# Altium schematic sheet ControlPanel.SchDoc
size A; SheetNumber: 6
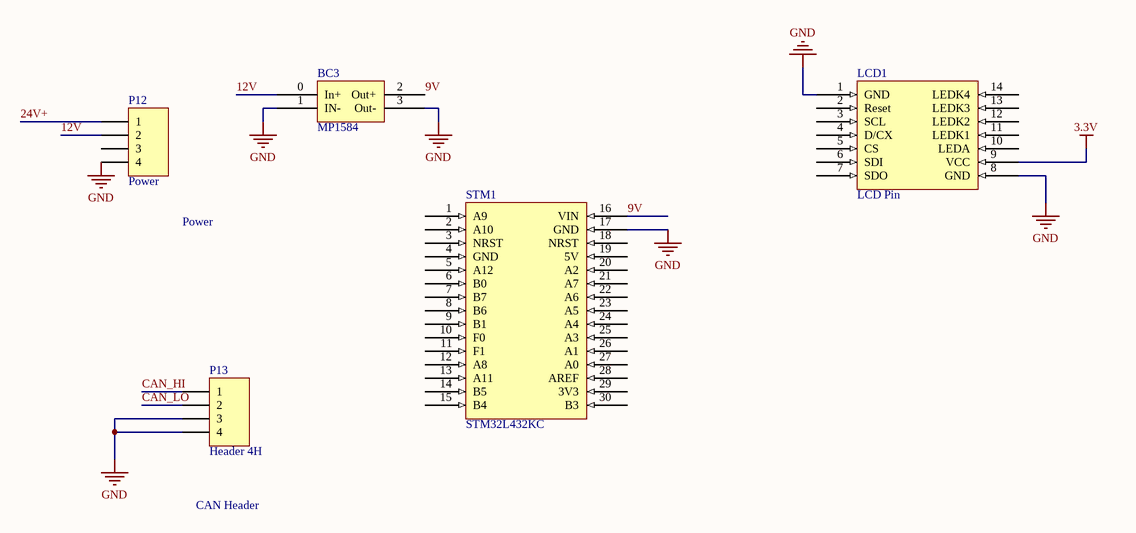
[diagram p0: ControlPanel.SchDoc]

## Parts
BC3  MP1584
LCD1  LCD Pin  [LCD Display Header]
P12  Power  [HDR1X4]
P13  Header 4H  [HDR1X4H]
STM1  STM32L432KC

## Nets
3.3V: LCD1.9(VCC)
GND: BC3.1(IN-) BC3.3(Out-) LCD1.1(GND) LCD1.8(GND) P12.4 P13.3 P13.4 STM1.17(GND)
9V: BC3.2(Out+) STM1.16(VIN)
12V: BC3.0(In+) P12.2
24V+: P12.1
CAN_HI: P13.1
CAN_LO: P13.2

Not connected (* = marked no-connect by the designer): LCD1 2(Reset) 3(SCL) 4(D/CX) 5(CS) 6(SDI) 7(SDO) 10(LEDA) 11(LEDK1) 12(LEDK2) 13(LEDK3) 14(LEDK4); P12 3; STM1 1(A9) 2(A10) 3(NRST) 4(GND) 5(A12) 6(B0) 7(B7) 8(B6) 9(B1) 10(F0) 11(F1) 12(A8) 13(A11) 14(B5) 15(B4) 18(NRST) 19(5V) 20(A2) 21(A7) 22(A6) 23(A5) 24(A4) 25(A3) 26(A1) 27(A0) 28(AREF) 29(3V3) 30(B3)

## Notes on the sheet
- Power
- CAN Header

## Library data of the parts
P12 = Header 4: Header, 4-Pin; LatestRevisionDate: 17-Jul-2002; LatestRevisionNote: Re-released for DXP Platform.; Publisher: Altium Limited
P13 = Header 4H: Header, 4-Pin, Right Angle; LatestRevisionDate: 17-Jul-2002; LatestRevisionNote: Re-released for DXP Platform.; Publisher: Altium Limited
STM1 = STMF303K8